# EAGLE design coreTwo (EAGLE 6.6.0)
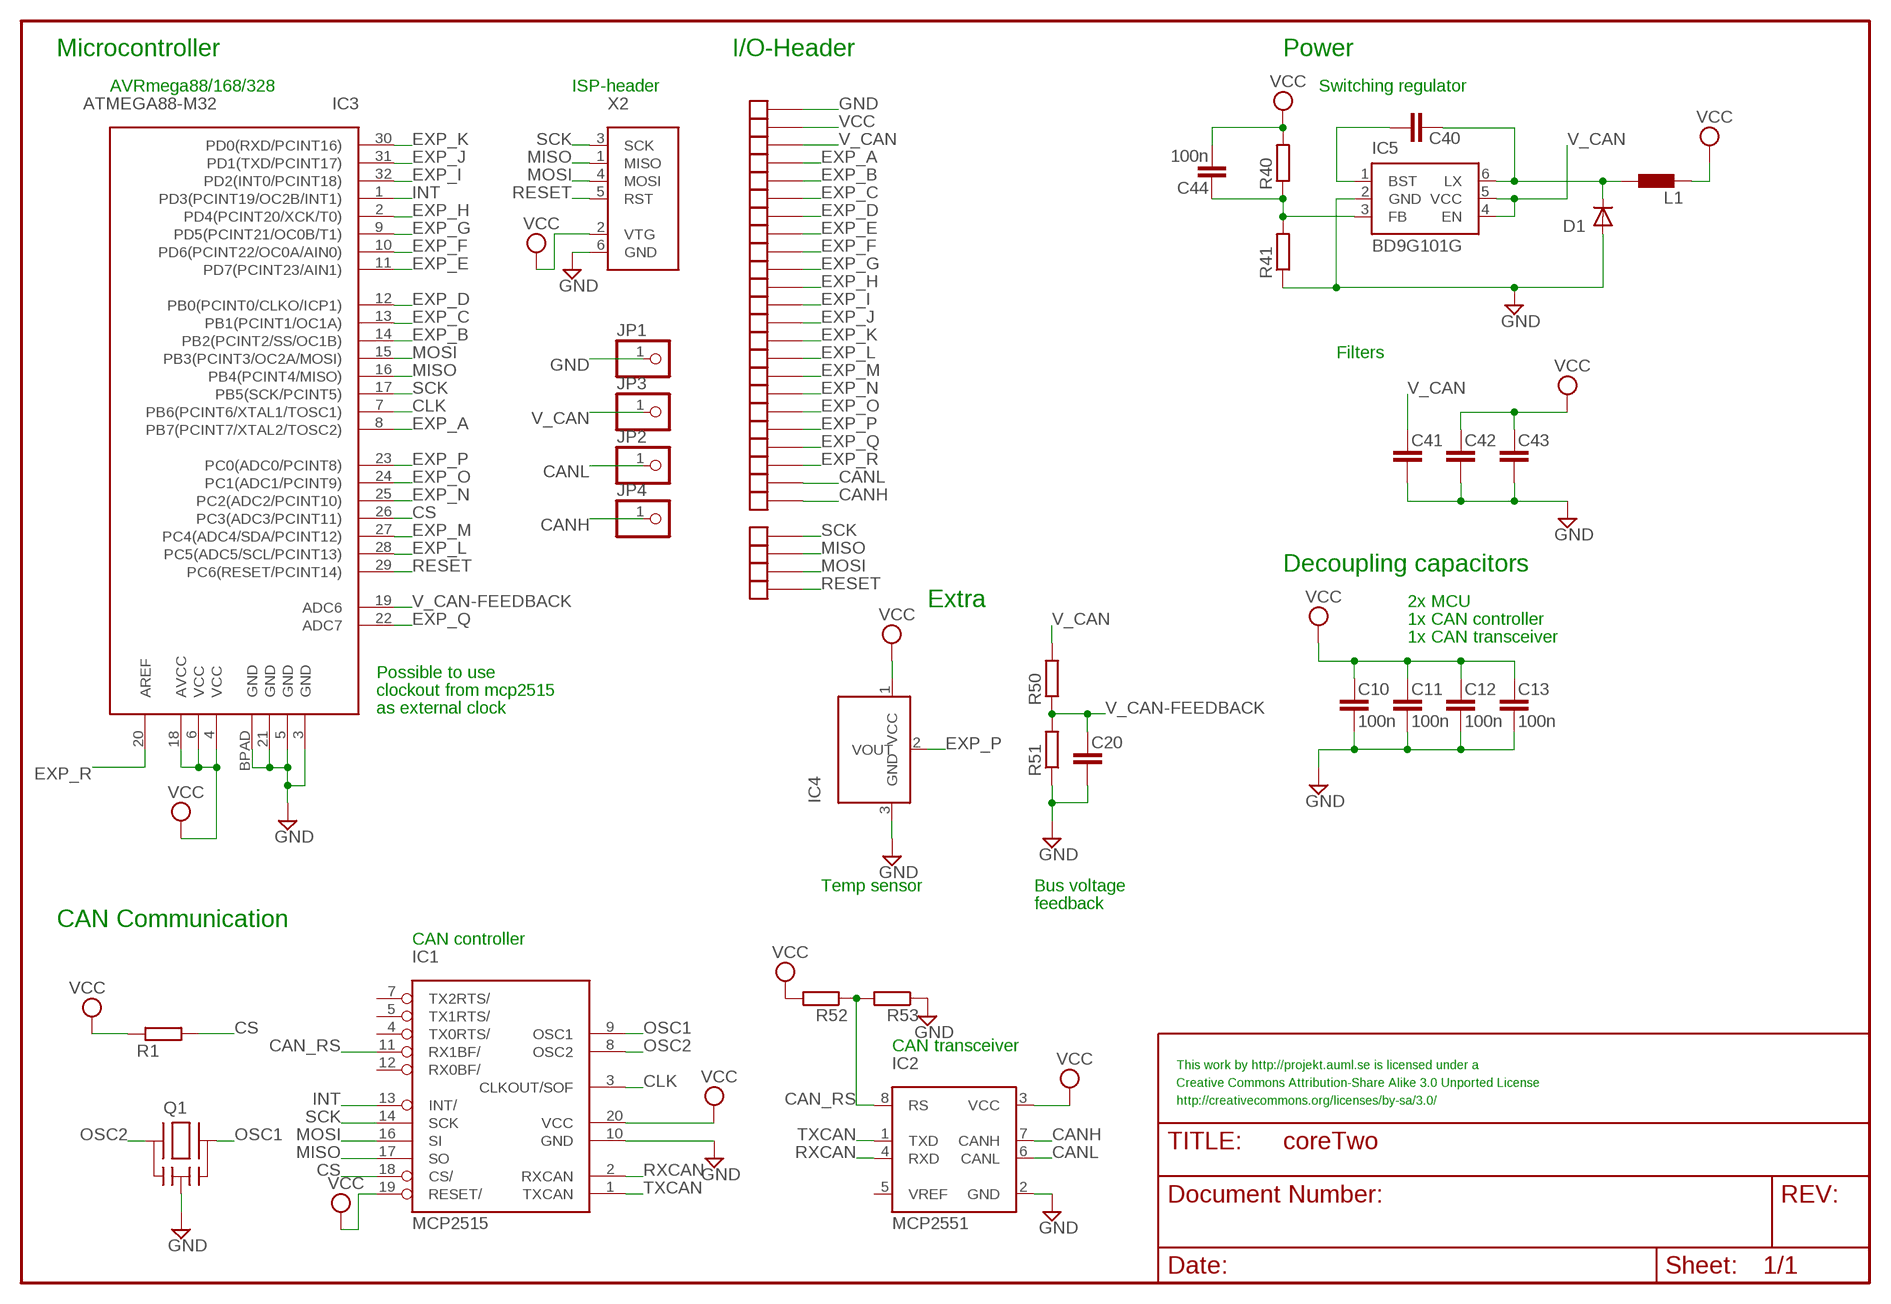
[diagram p0: schematic, sheet 1]

## Parts
C10  100n  C-EUC0402  [C0402]
C11  100n  C-EUC0402  [C0402]
C12  100n  C-EUC0402  [C0402]
C13  100n  C-EUC0402  [C0402]
C20  C-EUC0402  [C0402]
C40  C-EUC0603  [C0603]
C41  C-EUC1210  [C1210]
C42  C-EUC0805  [C0805]
C43  C-EUC0402  [C0402]
C44  100n  C-EUC0402  [C0402]
CANH  CORETWO_PIN  [CORETWO_PIN]
CANL  CORETWO_PIN  [CORETWO_PIN]
D1  DIODESMP  [DO-220AA]
EXP_A  CORETWO_PIN  [CORETWO_PIN]
EXP_B  CORETWO_PIN  [CORETWO_PIN]
EXP_C  CORETWO_PIN  [CORETWO_PIN]
EXP_D  CORETWO_PIN  [CORETWO_PIN]
EXP_E  CORETWO_PIN  [CORETWO_PIN]
EXP_F  CORETWO_PIN  [CORETWO_PIN]
EXP_G  CORETWO_PIN  [CORETWO_PIN]
EXP_H  CORETWO_PIN  [CORETWO_PIN]
EXP_I  CORETWO_PIN  [CORETWO_PIN]
EXP_J  CORETWO_PIN  [CORETWO_PIN]
EXP_K  CORETWO_PIN  [CORETWO_PIN]
EXP_L  CORETWO_PIN  [CORETWO_PIN]
EXP_M  CORETWO_PIN  [CORETWO_PIN]
EXP_N  CORETWO_PIN  [CORETWO_PIN]
EXP_O  CORETWO_PIN  [CORETWO_PIN]
EXP_P  CORETWO_PIN  [CORETWO_PIN]
EXP_Q  CORETWO_PIN  [CORETWO_PIN]
EXP_R  CORETWO_PIN  [CORETWO_PIN]
GND  CORETWO_PIN  [CORETWO_PIN]
IC1  MCP2515  [TSSOP]
IC2  MCP2551  [SOIC]
IC3  ATMEGA88-M32  [MLF32]
IC4  TC1047A  [SOT23]
IC5  BD9G101G  [SSOP6]
JP1  PINHD-1X1SMD  [1X01_SMD]
JP2  PINHD-1X1SMD  [1X01_SMD]
JP3  PINHD-1X1SMD  [1X01_SMD]
JP4  PINHD-1X1SMD  [1X01_SMD]
L1  L-EUL1210  [L1210]
MISO  CORETWO_PIN  [CORETWO_PIN]
MOSI  CORETWO_PIN  [CORETWO_PIN]
Q1  CSTCESMD  [SMD]
R1  R-EUR0402  [R0402]
R40  R-EUR0402  [R0402]
R41  R-EUR0402  [R0402]
R50  R-EUR0402  [R0402]
R51  R-EUR0402  [R0402]
R52  R-EUR0402  [R0402]
R53  R-EUR0402  [R0402]
RST  CORETWO_PIN  [CORETWO_PIN]
SCK  CORETWO_PIN  [CORETWO_PIN]
V_CAN  CORETWO_PIN  [CORETWO_PIN]
VCC  CORETWO_PIN  [CORETWO_PIN]
X2  AVRISP6PIN  [6PINSMD]

## Nets
CAN_RS: IC1.11(RX1BF/) IC2.8(RS) R52.1 R53.2
CANH: CANH.1(EXP_) IC2.7(CANH) JP4.1
CANL: CANL.1(EXP_) IC2.6(CANL) JP2.1
CB: C40.1 IC5.1(BST)
CLK: IC1.3(CLKOUT/SOF) IC3.7(PB6(PCINT6/XTAL1/TOSC1))
CS: IC1.18(CS/) IC3.26(PC3(ADC3/PCINT11)) R1.2
EXP_A: EXP_A.1(EXP_) IC3.8(PB7(PCINT7/XTAL2/TOSC2))
EXP_B: EXP_B.1(EXP_) IC3.14(PB2(PCINT2/SS/OC1B))
EXP_C: EXP_C.1(EXP_) IC3.13(PB1(PCINT1/OC1A))
EXP_D: EXP_D.1(EXP_) IC3.12(PB0(PCINT0/CLKO/ICP1))
EXP_E: EXP_E.1(EXP_) IC3.11(PD7(PCINT23/AIN1))
EXP_F: EXP_F.1(EXP_) IC3.10(PD6(PCINT22/OC0A/AIN0))
EXP_G: EXP_G.1(EXP_) IC3.9(PD5(PCINT21/OC0B/T1))
EXP_H: EXP_H.1(EXP_) IC3.2(PD4(PCINT20/XCK/T0))
EXP_I: EXP_I.1(EXP_) IC3.32(PD2(INT0/PCINT18))
EXP_J: EXP_J.1(EXP_) IC3.31(PD1(TXD/PCINT17))
EXP_K: EXP_K.1(EXP_) IC3.30(PD0(RXD/PCINT16))
EXP_L: EXP_L.1(EXP_) IC3.28(PC5(ADC5/SCL/PCINT13))
EXP_M: EXP_M.1(EXP_) IC3.27(PC4(ADC4/SDA/PCINT12))
EXP_N: EXP_N.1(EXP_) IC3.25(PC2(ADC2/PCINT10))
EXP_O: EXP_O.1(EXP_) IC3.24(PC1(ADC1/PCINT9))
EXP_P: EXP_P.1(EXP_) IC3.23(PC0(ADC0/PCINT8)) IC4.2(VOUT)
EXP_Q: EXP_Q.1(EXP_) IC3.22(ADC7)
EXP_R: EXP_R.1(EXP_) IC3.20(AREF)
GND: C10.2 C11.2 C12.2 C13.2 C20.2 C41.2 C42.2 C43.2 D1.A GND.1(EXP_) IC1.10(GND) IC2.2(GND) IC3.3(GND) IC3.5(GND) IC3.21(GND) IC3.BPAD(GND) IC4.3(GND) IC5.2(GND) JP1.1 Q1.2(GND) R41.1 R51.1 R53.1 X2.6(GND)
INT: IC1.13(INT/) IC3.1(PD3(PCINT19/OC2B/INT1))
MISO: IC1.17(SO) IC3.16(PB4(PCINT4/MISO)) MISO.1(EXP_) X2.1(MISO)
MOSI: IC1.16(SI) IC3.15(PB3(PCINT3/OC2A/MOSI)) MOSI.1(EXP_) X2.4(MOSI)
N$1: C44.1 IC5.3(FB) R40.1 R41.2
OSC1: IC1.9(OSC1) Q1.3
OSC2: IC1.8(OSC2) Q1.1
RESET: IC3.29(PC6(RESET/PCINT14)) RST.1(EXP_) X2.5(RST)
RXCAN: IC1.2(RXCAN) IC2.4(RXD)
SCK: IC1.14(SCK) IC3.17(PB5(SCK/PCINT5)) SCK.1(EXP_) X2.3(SCK)
TXCAN: IC1.1(TXCAN) IC2.1(TXD)
V_CAN: C41.1 IC5.4(EN) IC5.5(VCC) JP3.1 R50.2 V_CAN.1(EXP_)
V_CAN-FEEDBACK: C20.1 IC3.19(ADC6) R50.1 R51.2
VCC: C10.1 C11.1 C12.1 C13.1 C42.1 C43.1 C44.2 IC1.19(RESET/) IC1.20(VCC) IC2.3(VCC) IC3.4(VCC) IC3.6(VCC) IC3.18(AVCC) IC4.1(VCC) L1.1 R1.1 R40.2 R52.2 VCC.1(EXP_) X2.2(VTG)
VSW: C40.2 D1.C IC5.6(LX) L1.2
Unconnected: IC1.4(TX0RTS/) IC1.5(TX1RTS/) IC1.7(TX2RTS/) IC1.12(RX0BF/) IC2.5(VREF)

## Notes on the sheet
- Microcontroller | I/O-Header | Power
- AVRmega88/168/328 | ISP-header | Switching regulator
- Filters
- Decoupling capacitors
- Extra | 2x MCU
- 1x CAN controller
- 1x CAN transceiver
- Possible to use
- clockout from mcp2515
- as external clock
- Temp sensor | Bus voltage
- feedback
- CAN Communication
- CAN controller
- CAN transceiver
- This work by http://projekt.auml.se is licensed under a
- Creative Commons Attribution-Share Alike 3.0 Unported License
- http://creativecommons.org/licenses/by-sa/3.0/

## Library data of the parts
C10-C13 C20 C40-C44 = rcl:C-EU
CANH CANL EXP_A EXP_B EXP_C EXP_D EXP_E EXP_F EXP_G EXP_H EXP_I EXP_J EXP_K EXP_L EXP_M EXP_N EXP_O EXP_P EXP_Q EXP_R GND MISO MOSI RST SCK V_CAN VCC = expboard:CORETWO_PIN
D1 = diode:DIODE: DIODE ultra fast rectifier, 3 A
IC1 = mcp2515:MCP2515
IC2 = mcp2551:MCP2551
IC3 = atmega88:ATMEGA88-M32
IC4 = tc1047a:TC1047A
IC5 = BD9G101G:BD9G101G
JP1-JP4 = pinhead-mm:PINHD-1X1
L1 = rcl:L-EU
Q1 = xtal_CSTCE:CSTCE
R1 R40 R41 R50-R53 = rcl:R-EU
X2 = avrisp:AVRISP6PIN

## Board
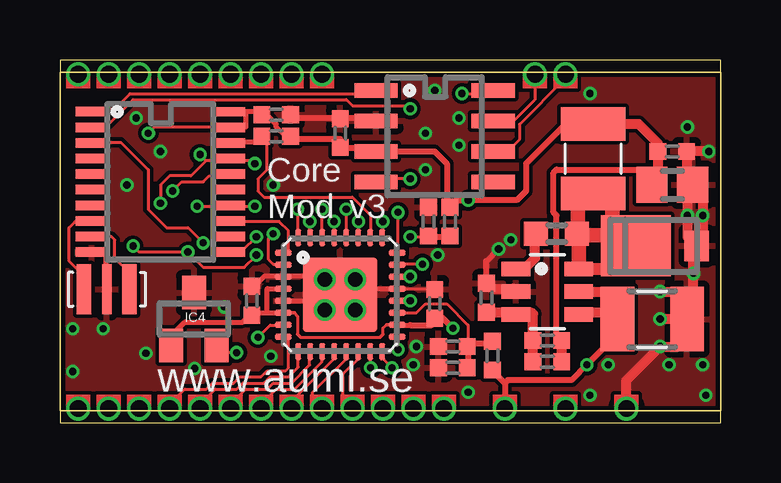
[diagram p1: board, top side]
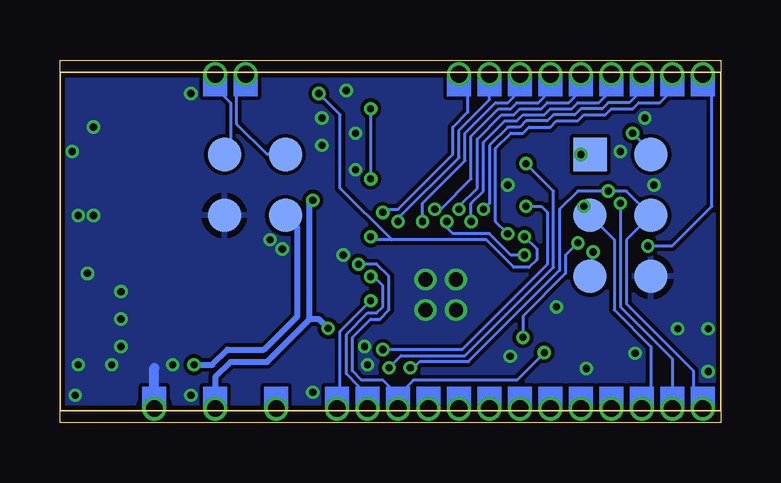
[diagram p2: board, bottom side, seen from below]

Size 27.56 x 15.11 mm. Coordinates in mm from the lower left corner, seen from the top.
Outline: 27.56,0.51 27.56,14.61
Outline: 27.56,14.61 27.56,15.11 0,15.11 0,14.61
Outline: 0,14.61 0,0.51
Outline: 0,0.51 0,0 27.56,0 27.56,0.51
Outline: 27.56,14.61 0,14.61
Outline: 0,0.51 27.56,0.51
Copper layers (1*16): Top 0.035mm / dielectric 1.5mm / Bottom 0.035mm
Design rules "10mils, 0.6drill *": minimum track width 5mil, minimum drill 0.3mm, track to track 5mil, track to pad 5mil, pad to pad 6mil, via to via 6mil, smd to smd 0mil, copper to edge 8mil, drill to drill 10mil, minimum pad ring 1mil, minimum via ring 5mil, stop-mask expansion 0mil, vias tented up to drill 0.7mm, thermal gap 10mil
Milling: 4 lines

### Footprints (pad centres in the part's own frame; a part is rotated, then mirrored left to right if it is on the bottom)
C0402 = smd 0.7 x 0.7: 1 -0.6,0; 2 0.6,0
C0603 = smd 1 x 1: 1 -0.85,0; 2 0.85,0
C1210 = smd 1.4 x 2.7: 1 -1.4,0; 2 1.5,0
C0805 = smd 1.3 x 1.5: 1 -0.85,0; 2 0.85,0
CORETWO_PIN = drill 0.7 pad 1: 1 0,-0.084
DO-220AA = smd 1.016 x 1.27: A 1.143,0 | smd 2.921 x 2.54: C -1.397,0
TSSOP = smd 0.396 x 1.3: 1 -2.925,-2.875; 2 -2.275,-2.875; 3 -1.625,-2.875; 4 -0.975,-2.875; 5 -0.325,-2.875; 6 0.325,-2.875; 7 0.975,-2.875; 8 1.625,-2.875; 9 2.275,-2.875; 10 2.925,-2.875; 11 2.925,2.875; 12 2.275,2.875; 13 1.625,2.875; 14 0.975,2.875; 15 0.325,2.875; 16 -0.325,2.875; 17 -0.975,2.875; 18 -1.625,2.875; 19 -2.275,2.875 | smd 0.369 x 1.3: 20 -2.925,2.875
SOIC = smd 0.6 x 1.8: 1 -1.905,-2.44; 2 -0.635,-2.44; 3 0.635,-2.44; 4 1.905,-2.44; 5 1.905,2.44; 6 0.635,2.44; 7 -0.635,2.44; 8 -1.905,2.44
MLF32 = smd 0.7 x 0.24: 1 -2.375,1.75; 2 -2.375,1.25; 3 -2.375,0.75; 4 -2.375,0.25; 5 -2.375,-0.25; 6 -2.375,-0.75; 7 -2.375,-1.25; 8 -2.375,-1.75; 17 2.375,-1.75; 18 2.375,-1.25; 19 2.375,-0.75; 20 2.375,-0.25; 21 2.375,0.25; 22 2.375,0.75; 23 2.375,1.25; 24 2.375,1.75 | smd 0.24 x 0.7: 9 -1.75,-2.375; 10 -1.25,-2.375; 11 -0.75,-2.375; 12 -0.25,-2.375; 13 0.25,-2.375; 14 0.75,-2.375; 15 1.25,-2.375; 16 1.75,-2.375; 25 1.75,2.375; 26 1.25,2.375; 27 0.75,2.375; 28 0.25,2.375; 29 -0.25,2.375; 30 -0.75,2.375; 31 -1.25,2.375; 32 -1.75,2.375 | smd 3.1 x 3.1: BPAD 0,0
SOT23 = smd 1 x 1.4: 1 -0.95,-1.1; 2 0.95,-1.1; 3 0,1.1
SSOP6 = smd 0.6 x 1.2: 1 -0.95,-1.306; 2 0,-1.306; 3 0.95,-1.306; 4 0.95,1.306; 5 0,1.306; 6 -0.95,1.306
1X01_SMD = smd 1.4 x 1.4: 1 0,0
L1210 = smd 1.4 x 2.7: 1 -1.4,0; 2 1.5,0
SMD = smd 0.6 x 2.1: 1 -0.27,0.1; 3 1.63,0.1 | smd 0.4 x 2.1: 2 0.68,0.1
R0402 = smd 0.7 x 0.7: 1 -0.6,0; 2 0.6,0
6PINSMD = smd 1.4 x 1.4 bottom: 1 0,2.54; 2 -2.54,2.54; 3 0,0; 4 -2.54,0; 5 0,-2.54; 6 -2.54,-2.54

### Placement (x,y rotation side)
C10  11.68,12.07 90 top
C11  15.62,4.95 90 top
C12  9.02,12.83 0 top
C13  8,5.08 90 top
C20  16.38,3.17 180 top
C40  20.7,7.87 0 top
C41  24.64,4.32 0 top
C42  25.53,9.91 0 top
C43  25.53,11.3 0 top
C44  20.32,2.54 0 top
CANH  19.81,14.61 0 top
CANL  21.08,14.61 0 top
D1  25.4,7.37 0 top
EXP_A  4.57,0.51 180 top
EXP_B  12.19,0.51 180 top
EXP_C  10.92,0.51 180 top
EXP_D  9.65,0.51 180 top
EXP_E  8.38,0.51 180 top
EXP_F  7.11,0.51 180 top
EXP_G  5.84,0.51 180 top
EXP_H  2.03,14.61 0 top
EXP_I  3.3,14.61 0 top
EXP_J  4.57,14.61 0 top
EXP_K  5.84,14.61 0 top
EXP_L  7.11,14.61 0 top
EXP_M  8.38,14.61 0 top
EXP_N  9.65,14.61 0 top
EXP_O  10.92,14.61 0 top
EXP_P  13.46,0.51 180 top
EXP_Q  14.73,0.51 180 top
EXP_R  16,0.51 180 top
GND  23.62,0.51 180 top
IC1  4.19,10.04 270 top
IC2  15.62,11.94 270 top
IC3  11.68,5.33 0 top
IC4  5.59,4.32 0 top
IC5  20.32,5.46 270 top
JP1  20.7,8.64 0 bottom
JP2  20.7,11.18 0 bottom
JP3  18.16,8.64 0 bottom
JP4  18.16,11.18 0 bottom
L1  22.23,11.05 270 top
MISO  2.03,0.51 180 top
MOSI  0.76,0.51 180 top
Q1  1.27,5.46 0 top
R1  9.02,11.94 180 top
R40  20.32,3.43 0 top
R41  17.78,5.21 270 top
R50  18.03,2.79 270 top
R51  16.38,2.29 0 top
R52  16.26,8.38 90 top
R53  15.37,8.38 270 top
RST  0.76,14.61 0 top
SCK  3.3,0.51 180 top
V_CAN  18.54,0.51 180 top
VCC  21.08,0.51 180 top
X2  5.46,8.64 0 top

### Tracks (layer width: path | path; a pad name or v marks a point on that pad's centre or on a via)
CAN_RS  (via drill 0.3)
  Top 0.127: IC1.11 7.62,7.11 7.62,7.18 | 7.62,7.18 7.56,7.18 | 7.62,7.18 v8.19,7.75 | v16.76,13.72 17.93,13.72 IC2.8 | v14.61,7.75 15.08,7.75 R53.2
  Top 0.254: R53.2 15.11,7.75 16.26,7.75 R52.1 16.38,7.78
  Bottom 0.127: v8.19,7.75 7.68,7.24 7.68,6.79 8,6.48 8.64,6.48 9.78,7.62 13.72,7.62 | 13.72,7.62 15.88,9.78 15.88,12.83 v16.76,13.72 | 13.72,7.62 14.48,7.62 v14.61,7.75
CANH
  Top 0.127: IC2.7 18.92,12.57 19.81,13.46 CANH.1
  Bottom 0.127: JP4.1 18.92,11.18 20.19,12.45 20.19,13.97 19.81,14.35 19.81,14.48 CANH.1
CANL
  Top 0.127: IC2.6 18.67,11.3 19.18,11.81 19.18,12.45 21.08,14.35 CANL.1
  Bottom 0.127: JP2.1 20.45,11.43 20.45,13.33 21.08,13.97 CANL.1
CB
  Top 0.152: C40.1 19.81,7.87 19.68,7.75
  Top 0.406: IC5.1 19.36,6.41 19.81,6.86 19.81,7.83
  Top 0.61: C40.1 19.81,7.83
CLK  (via drill 0.3)
  Top 0.127: IC3.7 9.29,4.08 9.27,4.06 8.76,4.06 v8.26,3.56 | v5.97,7.49 5.33,8.13 4.45,8.13 3.68,8.89 3.68,10.54 2.54,11.68 1.4,11.68 1.37,11.66 IC1.3
  Bottom 0.127: v8.26,3.56 8.26,4.45 6.48,6.22 6.48,6.98 v5.97,7.49
CS
  Top 0.127: IC3.26 12.93,7.64 12.95,7.62 12.95,8.64 12.19,9.4 8.51,9.4 8.26,9.65 8.26,10.16 8.64,10.54 8.64,11.68 8.51,11.81 8.51,11.68
  Top 0.203: IC1.18 7.09,11.66 7.11,11.68 8.51,11.68 R1.2
EXP_A
  Top 0.127: IC3.8 9.5,3.58 9.53,3.56 9.53,2.29 9.4,2.16 8.64,2.16 8.38,1.9 7.49,1.9 7.24,1.65 6.35,1.65 6.1,1.4 5.21,1.4 4.57,0.76 EXP_A.1
EXP_B
  Top 0.127: IC3.14 12.43,2.93 12.45,2.92 12.45,2.67 11.81,2.03 11.81,1.14 EXP_B.1 12.19,0.63
EXP_C
  Top 0.127: IC3.13 11.93,2.92 11.94,2.92 11.94,2.67 10.54,1.27 10.54,1.02 EXP_C.1
EXP_D
  Top 0.127: IC3.12 11.43,2.92 11.43,2.67 9.78,1.02 9.65,1.02 EXP_D.1
EXP_E
  Top 0.127: IC3.11 10.93,2.93 10.92,2.92 10.92,2.54 9.78,1.4 9.02,1.4 8.51,0.89 EXP_E.1
EXP_F
  Top 0.127: IC3.10 10.43,2.94 10.41,2.92 10.41,2.41 9.65,1.65 8.89,1.65 8.64,1.4 7.75,1.4 7.11,0.76 EXP_F.1
EXP_G
  Top 0.127: IC3.9 9.93,2.31 9.53,1.9 8.76,1.9 8.51,1.65 7.62,1.65 7.37,1.4 6.48,1.4 5.84,0.76 EXP_G.1
EXP_H  (via drill 0.3)
  Top 0.127: IC3.2 9.29,6.6 8.89,6.6 8.7,6.79 8.7,7.68 v8.89,7.87
  Bottom 0.127: v8.89,7.87 9.4,8.38 9.4,11.43 8.76,12.07 8.26,12.07 8,12.32 7.11,12.32 6.86,12.57 5.97,12.57 5.71,12.83 4.83,12.83 4.57,13.08 3.68,13.08 3.43,13.33 2.54,13.33 2.03,13.84 2.03,14.48 EXP_H.1
EXP_I  (via drill 0.3)
  Top 0.127: IC3.32 9.93,7.85 9.91,7.87 v9.91,8.89
  Bottom 0.127: v9.91,8.89 9.65,9.14 9.65,11.56 8.89,12.32 8.38,12.32 8.13,12.57 7.24,12.57 6.98,12.83 6.1,12.83 5.84,13.08 4.95,13.08 4.7,13.33 3.81,13.33 3.3,13.84 3.3,14.48 EXP_I.1
EXP_J  (via drill 0.3)
  Top 0.127: IC3.31 10.43,7.64 10.41,7.62 v10.41,8.38
  Bottom 0.127: EXP_J.1 4.57,14.48 4.57,13.84 5.08,13.33 5.97,13.33 6.22,13.08 7.11,13.08 7.37,12.83 8.26,12.83 8.51,12.57 9.02,12.57 9.91,11.68 9.91,9.65 10.41,9.14 v10.41,8.38
EXP_K  (via drill 0.3)
  Top 0.127: v10.92,8.89 10.92,7.75 10.93,7.73 IC3.30
  Bottom 0.127: v10.92,8.89 10.92,9.02 10.16,9.78 10.16,11.81 9.14,12.83 8.64,12.83 8.38,13.08 7.49,13.08 7.24,13.33 6.35,13.33 5.84,13.84 5.84,14.48 EXP_K.1
EXP_L  (via drill 0.3)
  Top 0.127: v11.94,8.89 11.94,7.75 11.93,7.74 IC3.28
  Bottom 0.127: EXP_L.1 7.11,13.84 7.62,13.33 8.51,13.33 8.76,13.08 9.27,13.08 10.41,11.94 10.41,10.16 11.68,8.89 v11.94,8.89
EXP_M  (via drill 0.3)
  Top 0.127: v12.45,8.38 12.45,7.75 12.43,7.73 IC3.27
  Bottom 0.127: EXP_M.1 8.38,14.48 8.38,13.84 8.89,13.33 9.4,13.33 10.67,12.07 10.67,10.92 12.45,9.14 v12.45,8.38
EXP_N  (via drill 0.3)
  Top 0.127: IC3.25 13.43,7.72 13.46,7.75 v13.46,8.38
  Bottom 0.127: EXP_N.1 9.65,14.48 9.65,13.46 10.92,12.19 10.92,11.05 13.46,8.51 v13.46,8.38
EXP_O  (via drill 0.3)
  Top 0.127: IC3.24 14.07,7.08 14.1,7.11 v14.1,8.76
  Bottom 0.127: 10.92,14.48 EXP_O.1 10.54,14.48 10.54,12.95 11.18,12.32 11.18,11.18 13.46,8.89 13.97,8.89 v14.1,8.76
EXP_P  (via drill 0.3)
  Top 0.127: IC3.23 14.08,6.58 14.1,6.6 v15.11,6.6 | IC4.2 6.86,3.22 6.86,2.92 v7.37,2.92
  Bottom 0.127: v15.11,6.6 14.35,6.6 13.84,6.1 13.84,4.7 14.22,4.32 14.61,4.32 15.37,3.56 15.37,2.16 14.99,1.78 14.1,1.78 13.46,1.14 | 13.46,1.14 EXP_P.1 | v7.37,2.92 8.51,1.78 12.83,1.78 13.46,1.14
EXP_Q  (via drill 0.3)
  Top 0.127: IC3.22 14.09,6.08 14.1,6.1 v14.61,6.1
  Bottom 0.127: v14.61,6.1 14.48,6.1 14.1,5.71 14.1,4.83 14.35,4.57 14.73,4.57 15.62,3.68 15.62,2.03 15.11,1.52 15.11,0.89 EXP_Q.1
EXP_R  (via drill 0.3)
  Top 0.203: IC3.20 v14.6,5.08 v14.61,5.08
  Bottom 0.127: v14.61,5.08 15.88,3.81 15.88,1.27 16,1.14 EXP_R.1
GND  (via drill 0.3, 0.6)
  Top 0.127: IC3.21 15.49,5.58
  Top 0.203: C13.2 8.13,5.71 8.51,6.1 9.27,6.1 9.28,6.08 IC3.3 9.39,6.08 9.4,6.1 10.92,6.1 v11.05,5.97 IC3.BPAD | IC3.5 9.39,5.08 9.4,5.08 11.43,5.08 IC3.BPAD | IC3.21 13.97,5.58 13.97,5.59 11.94,5.59 IC3.BPAD | C11.2 15.62,5.59 15.49,5.58 | Q1.2 1.91,5.61 1.91,7.11 1.9,7.11 IC1.10
  Top 0.254: IC2.2 13.18,12.6 13.08,12.7 11.68,12.7 | C12.2 9.65,12.83 9.78,12.7 11.68,12.7 | 11.68,12.7 C10.2 | R41.1 17.78,6.73 v18.29,7.24
  Top 0.406: v25.02,4.32 C41.2 26.14,3.83 26.16,3.81 | v25.02,5.46 26.04,5.46 26.16,5.33 | 26.16,5.33 26.42,5.33 v26.42,6.22 26.42,7.24 D1.A | v26.8,8.64 26.8,7.62 D1.A | D1.A 26.16,7.75 v26.16,8.64 26.16,9.52 26.38,9.74 C42.2 | C42.2 26.67,9.91 26.8,9.78 26.8,8.76 | v27.05,11.3 C43.2 26.13,10.16 C42.2 | 26.16,3.81 26.16,3.56 arc-90 25.78,3.17 v25.02,3.17 23.62,1.78 GND.1 | 26.16,3.81 26.16,5.33 | R41.1 17.82,5.81 18.03,5.59 18.89,5.59 IC5.2
  Bottom 0.406: 23.62,0.76 23.62,2.29
  other vias: 15.24,12.07 12.32,5.97 11.05,4.7 12.32,4.7 6.86,4.83 1.8,3.91 8.89,9.91 17.02,1.27 15.75,6.98 15.24,10.54 22.1,13.72 26.16,12.32 25.4,2.41 26.8,2.41 18.8,7.62 22.1,1.14 22.86,2.41 26.92,1.14 15.62,13.84 16.64,12.7 16.64,11.56 4.19,11.3 3.17,12.7 2.79,9.91 0.53,3.91 0.53,2.13 3.58,2.9 5.61,2.26 8.79,2.77 14.73,2.41 14.86,3.17
  pour Bottom (isolate 0.152, rank 3): 27.56,14.61 27.56,0.51 0,0.51 0,14.61
  pour Top (isolate 0.152, rank 3): 27.56,14.61 27.56,0.51 0,0.51 0,14.61
INT
  Top 0.127: IC3.1 9.27,7.11 9.53,7.11 9.53,8 9.14,8.38 7.11,8.38 7.08,8.41 IC1.13
MISO  (via drill 0.3)
  Top 0.127: IC3.16 13.46,2.67 v13.84,2.29 | 6.1,10.92 v5.84,11.18 | 6.1,10.92 6.98,10.92 6.98,10.93 IC1.17 7.06,10.97 7.11,10.92 8,10.92 v8.13,10.79 | 6.1,10.92 5.46,10.29 4.57,10.29 4.19,9.91 v4.19,9.14
  Bottom 0.127: v13.84,2.29 13.34,2.79 10.67,2.79 6.98,6.48 6.98,9.65 v8.13,10.79 | v5.84,11.18 X2.1 | v4.19,9.14 4.19,4.83 2.03,2.67 MISO.1
MOSI  (via drill 0.3)
  Top 0.127: IC3.15 12.95,2.94 v12.95,2.29 | v4.7,9.65 5.08,10.03 5.97,10.03 6.22,10.29 7.11,10.29 IC1.16
  Bottom 0.127: v12.95,2.29 12.83,2.29 12.57,2.54 10.54,2.54 6.73,6.35 6.73,8.89 5.97,9.65 v4.7,9.65 3.94,9.65 X2.4 3.94,7.62 3.94,4.95 1.14,2.16 1.14,0.97 MOSI.1
N$1
  Top 0.254: 18.92,4.61 IC5.3 19.07,4.57
  Top 0.406: 19.07,4.57 19.68,4.57 19.72,4.54 R40.1 C44.1 | R41.2 18.92,4.61
OSC1
  Top 0.127: 1.4,7.75 1.38,7.76 IC1.9 1.4,7.75 | 1.4,7.75 2.16,7.75 2.29,7.62 2.29,6.86 2.9,6.25 Q1.3
OSC2
  Top 0.127: IC1.8 1.3,8.41 1.27,8.38 0.63,8.38 0.38,8.13 0.38,6.73 0.89,6.22 0.89,5.59 0.92,5.56 Q1.1
RESET  (via drill 0.3)
  Top 0.127: v11.43,8.38 11.43,7.75 11.43,7.74 IC3.29 | v8.19,6.98 7.68,6.48 5.97,6.48 v5.33,7.11 3.3,7.11 v3.05,7.37
  Bottom 0.127: v11.43,8.38 11.43,8.13 11.18,7.87 9.65,7.87 8.76,6.98 v8.19,6.98 | X2.5 5.33,6.6 v5.33,7.11 | v3.05,7.37 2.03,7.37 0.38,9.02 0.38,14.14 RST.1
RXCAN  (via drill 0.3)
  Top 0.127: IC1.2 1.39,12.31 1.52,12.45 2.03,12.45 3.05,13.46 11.94,13.46 12.19,13.21 14.48,13.21 v14.61,13.08 | IC2.4 13.21,10.03 13.34,10.16 v14.61,10.16
  Bottom 0.127: v14.61,13.08 v14.61,10.16
SCK  (via drill 0.3)
  Top 0.127: IC3.17 14.21,3.56 14.1,3.56 v14.1,3.05 | v5.71,9.02 7.11,9.02 | 7.11,9.02 IC1.14 | 7.11,9.02 v8.13,9.02
  Bottom 0.127: v14.1,3.05 10.79,3.05 7.24,6.6 7.24,8.76 7.49,9.02 v8.13,9.02 | X2.3 5.46,8.76 v5.71,9.02 | X2.3 5.21,8.64 | X2.3 4.45,7.62 4.45,4.7 2.92,3.17 2.92,0.97 SCK.1
TXCAN
  Top 0.127: IC1.1 1.31,13 1.4,13.08 2.29,13.08 2.92,13.72 13.08,13.72 13.21,13.84 IC2.1
V_CAN  (via drill 0.3)
  Top 0.254: 18.54,0.76 V_CAN.1 18.54,1.65 | R50.2 18.03,2.16 18.54,1.65 | IC5.4 21.72,4.42 | 18.54,1.65 18.67,1.78 21.34,1.78 v21.97,2.41 22.99,3.43 22.86,3.56 C41.1
  Top 0.406: IC5.4 21.69,4.57 22.86,4.57 23.11,4.32 C41.1 22.99,4.57 22.99,5.33 22.86,5.46 IC5.5
  Bottom 0.254: v21.97,2.41 21.21,2.41 20.57,3.05 19.05,3.05 17.65,4.45 17.65,8.13 JP3.1
V_CAN-FEEDBACK
  Top 0.127: 14.1,4.57 14.86,4.57 15.24,4.95 16.13,4.95 17.02,4.06 17.02,3.43 C20.1
  Top 0.203: IC3.19 14.09,4.58 14.1,4.57 | C20.1 16.98,3.21
  Top 0.254: R50.1 18,3.39 17.91,3.3 17.02,3.3 | R51.2 17.11,2.25 17.02,2.29 17.02,3.3 | C20.1 17.02,3.3
VCC  (via drill 0.3)
  Top 0.127: IC3.4 9.28,5.58 9.27,5.59 | 9.78,4.57 9.91,4.45 9.91,3.68 | 10.03,3.56 13.34,3.56 | 13.46,3.68 13.46,3.94 13.61,4.08 | 7.75,12.32 7.07,12.32 | 7.07,12.32 IC1.19 | v3.68,12.07 3.94,12.32 7.07,12.32
  Top 0.152: IC3.6 9.39,4.58 9.4,4.57 9.78,4.57 | 9.91,3.68 10.03,3.56 | 13.34,3.56 13.46,3.68 | 13.61,4.08 IC3.18
  Top 0.203: IC3.18 14.08,4.08 14.1,4.06 14.61,4.06 | 7.75,12.95 8.26,12.95 8.38,12.83 C12.1 8.64,12.83 9.02,12.45 9.02,12.32 9.4,11.94 9.65,11.94 9.78,11.81 | IC1.20 7.11,12.96 7.75,12.95 | IC1.19 7.1,12.31 7.75,12.32 7.75,12.95 | IC3.6 9.28,4.58 9.27,4.57 8.64,4.57 | 8.64,4.57 8.26,4.57 8.16,4.48 C13.1 7.91,4.48 7.62,4.19 5.21,4.19 4.83,3.81 4.83,3.41 IC4.1 | 9.27,5.59 8.64,5.59 8.64,4.57
  Top 0.254: C11.1 15.62,4.45 | C11.1 15.53,4.35 15.49,4.06 14.61,4.06 | R1.1 9.78,11.81 11.68,11.81 C10.1 11.68,11.43 12.95,11.43 13.08,11.3 IC2.3 15.62,11.3 16.13,10.79 16.13,9.11 R52.2 16.55,9.27 v17.02,9.27 19.05,9.27 19.43,9.65 19.43,10.79 21.09,12.45 L1.1 | R40.2 20.7,3.34 20.7,8.64 20.57,8.76 20.57,10.41 20.7,10.54 24.8,10.54 24.93,10.41 | v16.38,3.94 15.97,4.35 C11.1
  Top 0.406: C42.1 24.93,10.16 24.93,10.41 C43.1 24.93,11.65 24.13,12.45 L1.1 | C44.2 R40.2
  Bottom 0.127: X2.2 2.92,11.3 v3.68,12.07
  Bottom 0.254: VCC.1 21.08,1.9 20.45,2.54 18.92,2.54 17.14,4.32 | 17.14,4.32 17.14,9.14 v17.02,9.27 | v16.38,3.94 16.76,4.32 17.14,4.32
VSW
  Top 0.305: 23.75,7.64 D1.C
  Top 0.406: 24,6.41 D1.C | 21.63,7.81 21.63,7.87 C40.2 21.59,7.87 | 21.59,9.27 22.23,9.27 L1.2 22.32,9.46 23.02,9.46
  Top 0.508: IC5.6 24,6.41
  Top 0.61: IC5.6 21.63,7.81 24,7.81 | 21.59,7.87 21.59,9.27 | 23.02,9.46 23.02,8.06

### Text on the board
Top: Copper, top side
Bottom: Copper, bottom side
tPlace: Core | Mod | v3 | www.auml.se | Silcscreen, top side
tStop: Soldermask, top side
bStop: Soldermask, bottom side
Milling: Cut border
Document: Creative Commons Attribution-Share Alike 3.0 Unported License | This work by http://projekt.auml.se is licensed under a | http://creativecommons.org/licenses/by-sa/3.0/
Reference: Component layout